# Altium schematic sheet OvercurrentDetectionLogic.SchDoc
size A4; Organization: UltraZohm; DocumentNumber: 7; SheetNumber: 10; SheetTotal: 11; Website: www.ultrazohm.com
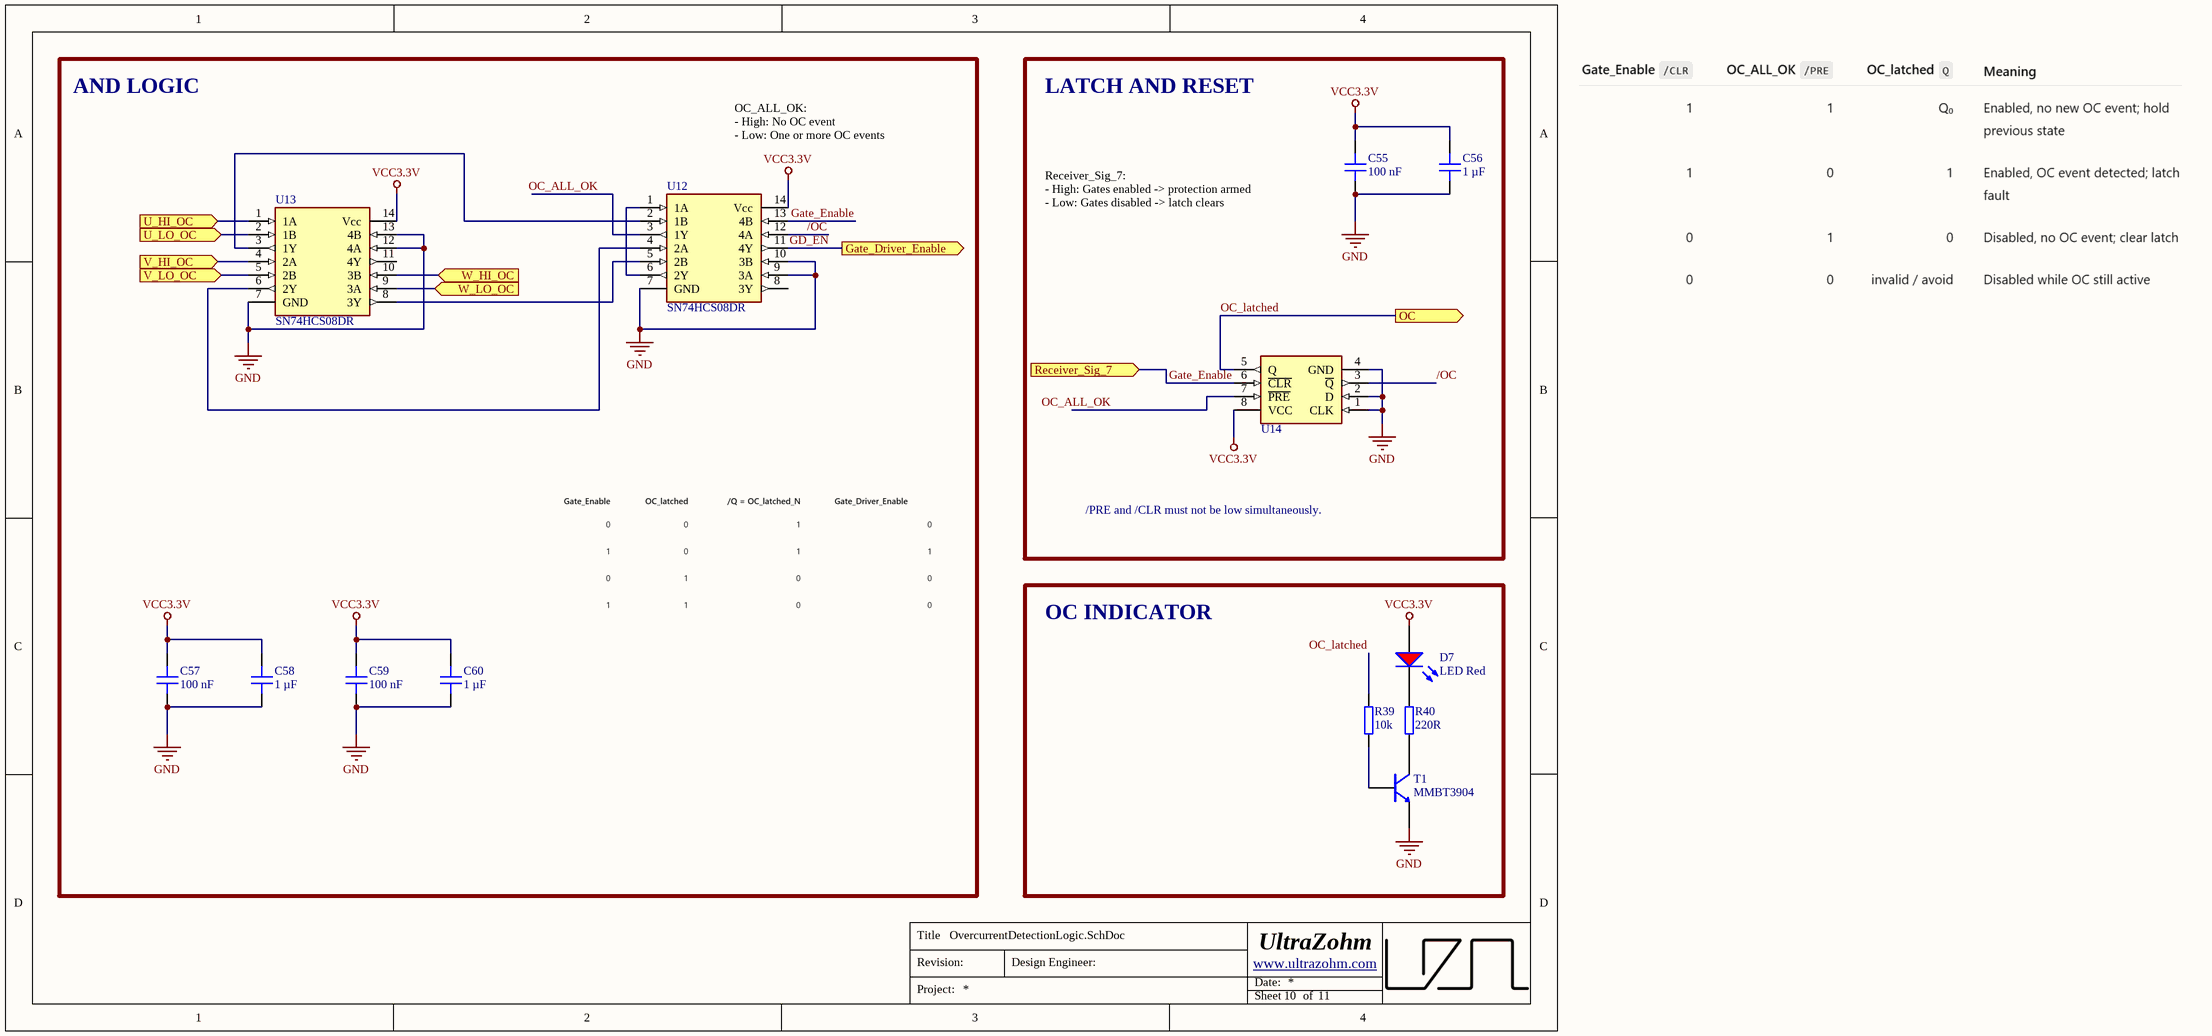
[diagram p0: OvercurrentDetectionLogic.SchDoc]

## Parts
C55  100 nF  [C_0603]
C56  1 µF  [C_0603]
C57  100 nF  [C_0603]
C58  1 µF  [C_0603]
C59  100 nF  [C_0603]
C60  1 µF  [C_0603]
D7  LED Red  [LEDM2012X80N]
R39  10k  [RES 0603_1608]
R40  220R  [RES 0603_1608]
T1  MMBT3904  [SOT95P280X145-3N]
U12  SN74HCS08DR  [SOIC127P600X175-14N]
U13  SN74HCS08DR  [SOIC127P600X175-14N]
U14  SN74LVC1G74DCTR  [MSOP-8]  (value not drawn)

## Blocks framed on the sheet
AND LOGIC: C57-C60 U12 U13
LATCH AND RESET: C55 C56 U14
OC INDICATOR: D7 R39 R40 T1

## Ports
Gate_Driver_Enable (out, see TopSheet[3B], GateAndFanControl[2B]), OC (out, see TopSheet[3B]), Receiver_Sig_7 (in, see TopSheet[2B]), U_HI_OC (in, see TopSheet[2B], OvercurrentDetection[2B]), U_LO_OC (in, see TopSheet[2B], OvercurrentDetection[2C]), V_HI_OC (in, see TopSheet[2B], OvercurrentDetection[4A]), V_LO_OC (in, see TopSheet[2B], OvercurrentDetection[4B]), W_HI_OC (in, see TopSheet[2B], OvercurrentDetection[4C]), W_LO_OC (in, see TopSheet[2B], OvercurrentDetection[4D])

## Nets
GND: C55.2 C56.2 C57.2 C58.2 C59.2 C60.2 T1.2(EMITTER) U12.7(GND) U12.9(3A) U12.10(3B) U13.7(GND) U13.12(4A) U13.13(4B) U14.1(CLK) U14.2(D) U14.4(GND)
VCC3.3V: C55.1 C56.1 C57.1 C58.1 C59.1 C60.1 D7.2(A) U12.14(Vcc) U13.14(Vcc) U14.8(VCC)
/OC: U12.12(4A) U14.3(~{Q})
Gate_Enable: U12.13(4B) U14.6(~{CLR}) ; port Receiver_Sig_7
GD_EN: U12.11(4Y) ; port Gate_Driver_Enable
OC_ALL_OK: U12.3(1Y) U14.7(~{PRE})
OC_latched: R39.2 U14.5(Q) ; port OC
U_HI_OC: U13.1(1A) ; port U_HI_OC
U_LO_OC: U13.2(1B) ; port U_LO_OC
V_HI_OC: U13.4(2A) ; port V_HI_OC
V_LO_OC: U13.5(2B) ; port V_LO_OC
W_HI_OC: U13.10(3B) ; port W_HI_OC
W_LO_OC: U13.9(3A) ; port W_LO_OC
NetD7_1: D7.1(K) R40.2
NetR39_1: R39.1 T1.1(BASIS)
NetR40_1: R40.1 T1.3(COLLECTOR)
NetU12_1: U12.1(1A) U12.6(2Y)
NetU12_2: U12.2(1B) U13.3(1Y)
NetU12_4: U12.4(2A) U13.6(2Y)
NetU12_5: U12.5(2B) U13.8(3Y)

Not connected (* = marked no-connect by the designer): U12 8(3Y); U13 11(4Y)

## Notes on the sheet
- OC_ALL_OK:
  - High: No OC event
  - Low: One or more OC events
- Receiver_Sig_7:
  - High: Gates enabled -> protection armed
  - Low: Gates disabled -> latch clears
- /PRE and /CLR must not be low simultaneously.
- Title
- Revision:
- Design Engineer:
- Date:
- Project:
- Sheet
- of

## Library data of the parts
C55 C57 C59 = C0603C104K5RAC3121: Capacitor 0603, 50 VDC, 100nF, X7R; Manufacturer: KEMET; Tolerance: 10 %; Voltage Rating: 50 VDC; Created from: DHufnagel; Manufacturer Part Number: C0603C104K5RAC3121; PartID: 99; Created On: 11/08/2022 14:33:29; ComponentLink1Description: Datasheet; ComponentLink1URL: https://www.mouser.de/datasheet/2/212/KEM_C1023_X7R_AUTO_SMD-1093309.pdf; Component Type: Capacitor 0603; Device Package: 0603; Last Updated: 19/08/2022 08:26:58; Mounting Type: SMD; Operating Temperature: -55 - 125°C; Series: X7R; Supplier 1: Mouser; Supplier Part Number 1: 80-C603C104K5RAC3121; Supplier 2: LCSC; Supplier Part Number 2: C14663; Type: Capacitor; Value: 100 nF; Live Cycle Status: 1; LCSC Part Number: C14663; Stock number: not stored
C56 C58 C60 = C0603C105K3RAC7411: Capacitor 0603, 25 VDC, 1 µF, X7R; Manufacturer: KEMET; Tolerance: 10 %; Voltage Rating: 25 VDC; Created from: MGremer; Manufacturer Part Number: C0603C105K3RAC7411; PartID: 4; Created On: 20/12/2020 13:54:13; ComponentLink1Description: Datasheet; ComponentLink1URL: https://www.mouser.de/datasheet/2/212/KEM_C1002_X7R_SMD-1102033.pdf; Component Type: Capacitor 0603; Device Package: 0603; Last Updated: 20/12/2020 16:43:05; Mounting Type: SMD; Operating Temperature: -55 - 125°C; Series: SMD Comm X7R; Supplier 1: Mouser; Supplier Part Number 1: 80-C0603C105K3RLR; Type: Capacitor; Value: 1 µF; Live Cycle Status: 1; Stock number: Labor SMD Container; LCSC Part Number: C29936
D7 = UZgen_LED_0805_Red: Standard LEDs - SMD 0805 red; Manufacturer: UZgen; Created from: UZgenTool; Manufacturer Part Number: UZgen_LED_0805_Red; PartID: 28; Created On: 09.09.2024 10:45:01; ComponentLink1Description: N/A; ComponentLink1URL: N/A; Component Type: LED Diode; Device Package: 0805; Last Updated: 09.09.2024 10:45:01; Mounting Type: SMD; Supplier 1: LCSC; Supplier Part Number 1: =LCSC Part Number; Type: Standard; Value: LED Red; Live Cycle Status: 1; Stock number: not stored; Color: red
R39 = RK73B1JTTD103J: SMD resistor E24 series; Manufacturer: KOA Speer; Tolerance: 5%; Created from: MGremer; Manufacturer Part Number: RK73B1JTTD103J; PartID: 98; Created On: 14.12.2020 16:17:14; ComponentLink1Description: Datasheet; ComponentLink1URL: https://www.mouser.de/datasheet/2/219/RK73B-1825463.pdf; Component Type: SMD resistor; Device Package: 0603; Last Updated: 27.05.2022 14:04:22; Mounting Type: SMD; Supplier 1: Mouser; Supplier Part Number 1: 660-RK73B1JTTD103J; Type: Resistor; Value: 10k; Live Cycle Status: 1; Stock number: Labor SMD Container; LCSC Part Number: C25804
R40 = RK73B1JTTDD221J: SMD resistor E24 series; Manufacturer: KOA Speer; Tolerance: 5%; Created from: MGremer; Manufacturer Part Number: RK73B1JTTDD221J; PartID: 58; Created On: 14.12.2020 16:17:14; ComponentLink1Description: Datasheet; ComponentLink1URL: https://www.mouser.de/datasheet/2/219/RK73B-1825463.pdf; Component Type: SMD resistor; Device Package: 0603; Last Updated: 02.03.2021 14:07:32; Mounting Type: SMD; Supplier 1: Mouser; Supplier Part Number 1: 660-RK73B1JTTDD221J; Type: Resistor; Value: 220R; Live Cycle Status: 1; Stock number: Labor SMD Container
T1 = MMBT3904: Bipolartransistor, 40V 200mW 200mA 100@10mA,1V 300MHz 300mV@50mA,5mA NPN +150℃@(Tj) SOT-23(SOT-23-3); Manufacturer: Jiangsu Changjing Electronics Technology Co., Ltd.; Number Of Channels: single; Collector Basis Voltage: 60 V; Created from: NDiringer; Manufacturer Part Number: MMBT3904; PartID: 2; Created On: 10.06.2022 12:04:49; ComponentLink1Description: Datasheet; ComponentLink1URL: https://datasheet.lcsc.com/lcsc/1811011934_Jiangsu-Changjing-Electronics-Technology-Co---Ltd--MMBT3904_C20526.pdf; Component Type: Bipolartransistor; Device Package: SOT-23-3; Last Updated: 10.08.2022 13:48:16; Mounting Type: SMD; Operating Temperature: -55 - 150 °C; Series: MMBT3904; Supplier 1: Mouser; Supplier Part Number 1: MMBT3904; Supplier 2: LCSC/JLCPCB; Supplier Part Number 2: C20526; Type: Bipolartransistor; Collector Emitter Voltage: 40 V; Polarization: NPN; Power Dissipation: 200 mW; Value: 40 V; Live Cycle Status: 1; LCSC Part Number: C20526
U12 U13 = SN74HCS08DR: Logische Gatter 4-ch 2-input 2-V to 6-V high-speed; Manufacturer: Texas Instruments; Value: 2 - 6 V; Created from: FRosner; Manufacturer Part Number: SN74HCS08DR; PartID: 11; Created On: 22.06.2026 16:12:32; ComponentLink1Description: Datasheet; ComponentLink1URL: https://www.ti.com/lit/ds/symlink/sn74hcs08.pdf?ts=1782076450125; Component Type: AND; Device Package: SOIC-14; Last Updated: 22.06.2026 16:23:25; Mounting Type: SMD; Operating Temperature: -40 to +125 °C; Series: SN74HCS08; Supplier 1: Mouser; Supplier Part Number 1: 595-SN74HCS08DR; Supplier 2: LCSC; Supplier Part Number 2: C2868021; Type: AND; Live Cycle Status: 1; Stock number: not stored; LCSC Part Number: C2868021
U14 = SN74LVC1G74DCTR: Single Positive-Edge-Triggered D-Type Flip-Flop with Clear and Preset; Manufacturer: Texas Instruments; Created from: FRosner; Manufacturer Part Number: SN74LVC1G74DCTR; PartID: 22; Created On: 11.06.2026 11:01:37; ComponentLink1Description: Datasheet; ComponentLink1URL: https://www.ti.com/lit/ds/symlink/sn74lvc1g74.pdf?ts=1781141639063; Component Type: Flip-Flops; Device Package: MSOP-8; Last Updated: 19.06.2026 11:11:41; Mounting Type: SMD; Operating Temperature: -40 - +125 °C; Supplier 1: LCSC; Supplier Part Number 1: C840104; Type: Flip-Flops; Live Cycle Status: 1; LCSC Part Number: C840104; Stock number: not stored